# Altium schematic sheet SWD.SchDoc
size A; SheetNumber: 6; SheetTotal: 12
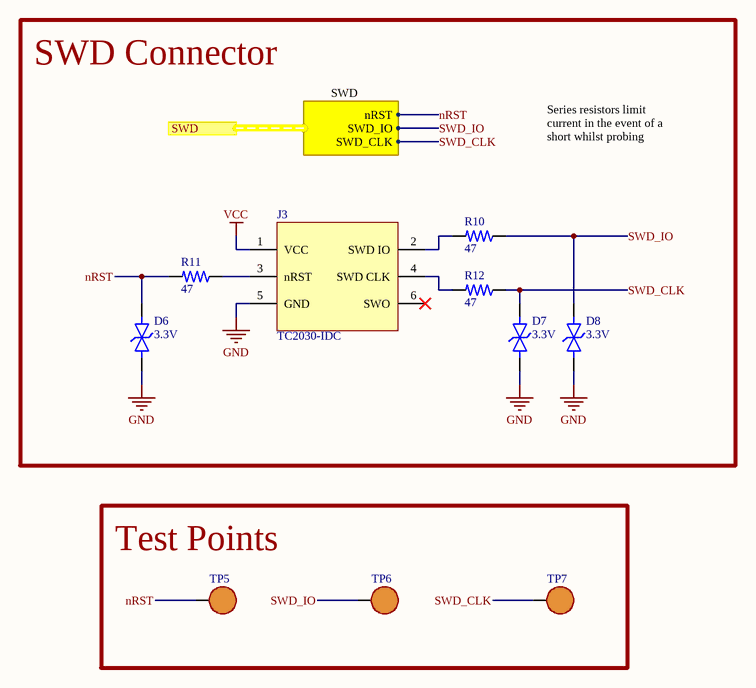
[diagram p0: SWD.SchDoc]

## Parts
D6  VRS: 3.3V  [0402-TVS]  (hidden comment: DESD3V3E1BL-7B)
D7  VRS: 3.3V  [0402-TVS]  (hidden comment: DESD3V3E1BL-7B)
D8  VRS: 3.3V  [0402-TVS]  (hidden comment: DESD3V3E1BL-7B)
J3  TC2030-IDC  [TAG CONNECT TC2030IDC - NO 3D MODEL]
R10  value 47  [0402R]  (hidden comment: RES)
R11  value 47  [0402R]  (hidden comment: RES)
R12  value 47  [0402R]  (hidden comment: RES)
TP5  RCWCTE  [RCWCTE]  (value not drawn)
TP6  RCWCTE  [RCWCTE]  (value not drawn)
TP7  RCWCTE  [RCWCTE]  (value not drawn)

## Blocks framed on the sheet
SWD Connector: D6-D8 J3 R10-R12
Test Points: TP5-TP7

## Ports
SWD (harness SWD, see Brain-PCB_MASTER[4C], MCU[1C])

## Harnesses
SWD: SWD_CLK, SWD_IO, nRST

## Nets
GND: D6.2 D7.2 D8.2 J3.5(GND)
VCC: J3.1(VCC)
nRST: D6.1 R11.2 TP5.1 ; port SWD.nRST
SWD_CLK: D7.1 R12.1 TP7.1 ; port SWD.SWD_CLK
SWD_IO: D8.1 R10.1 TP6.1 ; port SWD.SWD_IO
NetJ3_2: J3.2(SWD_IO) R10.2
NetJ3_3: J3.3(nRST) R11.1
NetJ3_4: J3.4(SWD_CLK) R12.2

Not connected (* = marked no-connect by the designer): J3 6(SWO)*

## Notes on the sheet
- Series resistors limit current in the event of a short whilst probing

## Library data of the parts
D6-D8 = TVS Diode 3.3V Bi: TVS DIODE 3.3VWM 7VC DFN1006-2; MFR: Diodes Incorporated; Type: SMD; VBR: 3.8V; VC: 7V; MFR PN: DESD3V3E1BL-7B
J3 = TC2030-IDC: "Plug of Nails" POGO Pin connector; MFR PN: TC2030-IDC-NL; MFR: Tag-Connect; Value: DNS
R10-R12 = RES: Resistor; MFR PN: RC0402FR-0747RL; MFR: YAGEO; Vendor: *; Vendor PN: *; Vendor Link: *; Type: SMD
TP5-TP7 = TEST POINT: Test Point, Surface Mount; MFR: KOA Speer Electronics, Inc.; MFR PN: RCWCTE; Type: SMD